# EAGLE design Group 6 (EAGLE 9.6.2)
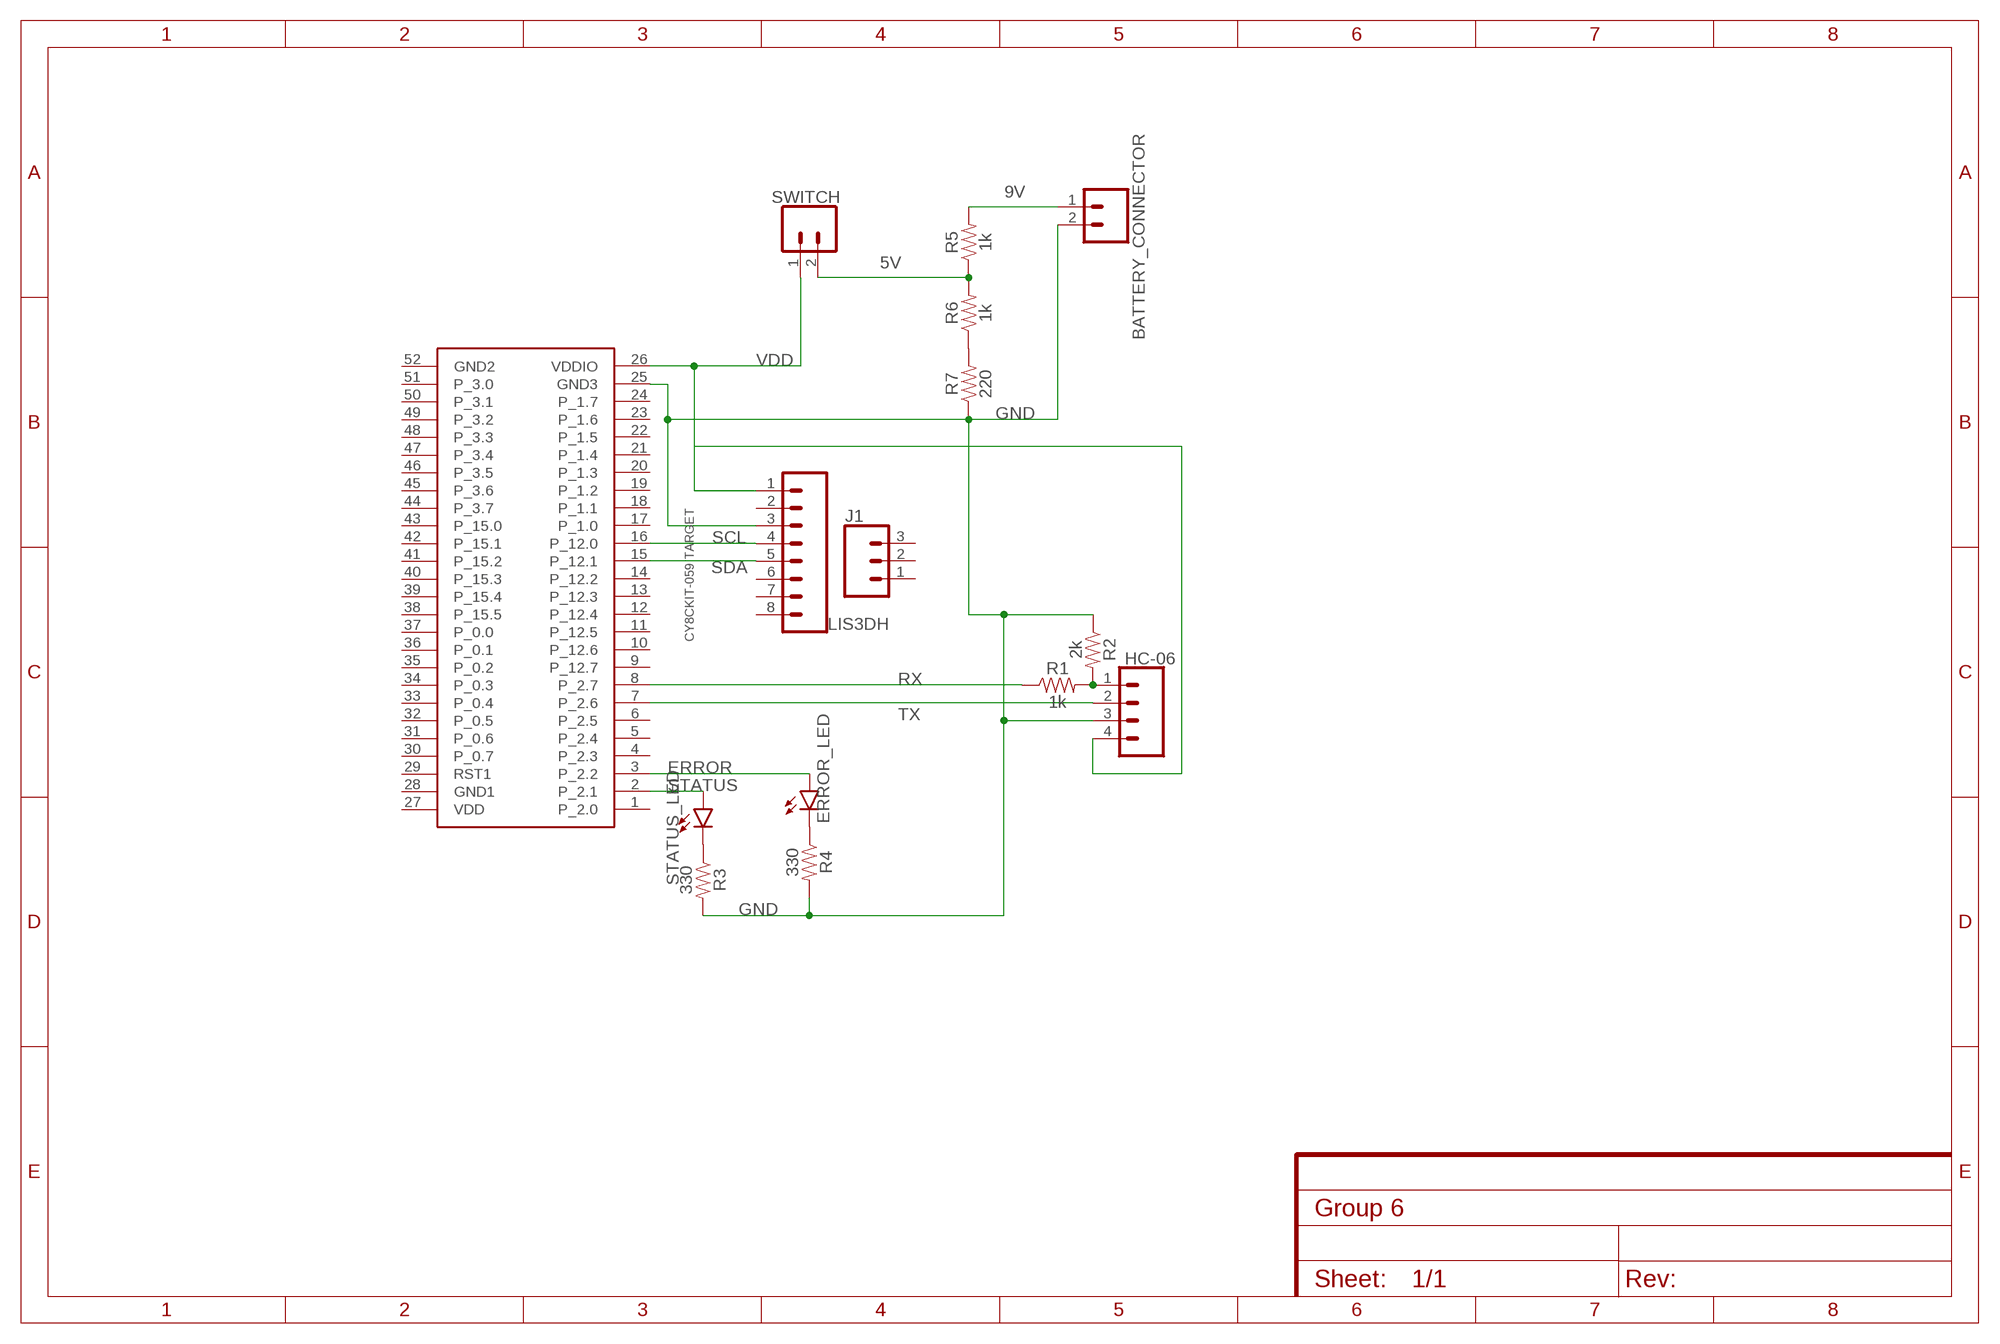
[diagram p0: schematic, sheet 1]

## Parts
BATTERY_CONNECTOR  CONN_02  [1X02]
ERROR_LED  LED-3MM-NO_SILK  [LED_3MM-NS]
HC-06  CONN_04PTH  [1X04]
J1  455-1750-1-ND  CONN_03  [1X03]
LIS3DH  CONN_08"  [1X08]
R1  1k  1KOHM-HORIZ-1/4W-1%  [AXIAL-0.3]
R2  2k  1KOHM-HORIZ-1/4W-1%  [AXIAL-0.3]
R3  330  330OHM-HORIZ-1/10W-5%  [AXIAL-0.3]
R4  330  330OHM-HORIZ-1/10W-5%  [AXIAL-0.3]
R5  1k  1KOHM-HORIZ-1/4W-1%  [AXIAL-0.3]
R6  1k  1KOHM-HORIZ-1/4W-1%  [AXIAL-0.3]
R7  220  1KOHM-HORIZ-1/4W-1%  [AXIAL-0.3]
STATUS_LED  LED-3MM-NO_SILK  [LED_3MM-NS]
SWITCH  CONN_02  [1X02]
U$1  CY8CKIT-059_TARGET_3  [CY8CKIT-059_TARGET_3]

## Nets
5V: R5.P$1 R6.P$2 SWITCH.2
9V: BATTERY_CONNECTOR.1 R5.P$2
ERROR: ERROR_LED.A U$1.3(P_2.2)
GND: BATTERY_CONNECTOR.2 HC-06.3 LIS3DH.3 R2.P$1 R3.P$2 R4.P$2 R7.P$1 U$1.25(GND3)
N$1: ERROR_LED.K(C) R4.P$1
N$2: R3.P$1 STATUS_LED.K(C)
N$3: HC-06.1 R1.P$2 R2.P$2
N$6: R6.P$1 R7.P$2
RX: R1.P$1 U$1.8(P_2.7)
SCL: LIS3DH.4 U$1.16(P_12.0)
SDA: LIS3DH.5 U$1.15(P_12.1)
STATUS: STATUS_LED.A U$1.2(P_2.1)
TX: HC-06.2 U$1.7(P_2.6)
VDD: HC-06.4 LIS3DH.1 SWITCH.1 U$1.26(VDDIO)
Unconnected: J1.1 J1.2 J1.3 LIS3DH.2 LIS3DH.6 LIS3DH.7 LIS3DH.8 U$1.1(P_2.0) U$1.4(P_2.3) U$1.5(P_2.4) U$1.6(P_2.5) U$1.9(P_12.7) U$1.10(P_12.6) U$1.11(P_12.5) U$1.12(P_12.4) U$1.13(P_12.3) U$1.14(P_12.2) U$1.17(P_1.0) U$1.18(P_1.1) U$1.19(P_1.2) U$1.20(P_1.3) U$1.21(P_1.4) U$1.22(P_1.5) U$1.23(P_1.6) U$1.24(P_1.7) U$1.29(RST1) U$1.30(P_0.7) U$1.31(P_0.6) U$1.32(P_0.5) U$1.33(P_0.4) U$1.34(P_0.3) U$1.35(P_0.2) U$1.36(P_0.1) U$1.37(P_0.0) U$1.38(P_15.5) U$1.39(P_15.4) U$1.40(P_15.3) U$1.41(P_15.2) U$1.42(P_15.1) U$1.43(P_15.0) U$1.44(P_3.7) U$1.45(P_3.6) U$1.46(P_3.5) U$1.47(P_3.4) U$1.48(P_3.3) U$1.49(P_3.2) U$1.50(P_3.1) U$1.51(P_3.0)

## Power pins joined to a net without a drawn wire
GND1: U$1.28(GND1)
GND2: U$1.52(GND2)
VDD: U$1.27(VDD)

## Library data of the parts
BATTERY_CONNECTOR SWITCH = SparkFun-Connectors:CONN_02: Multi connection point. Often used as Generic Header-pin footprint for 0.1 inch spaced/style header connections On any of the 0.1 inch spaced packages, you can populate with these: Break Away Headers - Straight <https://www.sparkfun.com/products/116> (PRT-00116) Break Away Male Headers - Right Angle <https://www.sparkfun.com/products/553> (PRT-00553) Female Headers <https://www.sparkfun.com/products/115> (PRT-00115) Break Away Headers - Machine Pin <https://www.sparkfun.com/products/117> (PRT-00117) Break Away Female Headers - Swiss Machine Pin <https://www.sparkfun.com/products/743> (PRT-00743) For SCREWTERMINALS and SPRING TERMINALS visit here: Screw Terimnals on SparkFun.com <https://www.sparkfun.com/search/results?term=Screw+Terminals> (5mm/3.5mm/2.54mm spacing) This device is also useful as a general connection point to wire up your design to another part of your project. Our various solder wires solder well into these plated through hole pads. Hook-Up Wire - Assortment (Stranded, 22 AWG) <https://www.sparkfun.com/products/11375> (PRT-11375) Hook-Up Wire - Assortment (Solid Core, 22 AWG) <https://www.sparkfun.com/products/11367> (PRT-11367) View the entire wire category on our website here <https://www.sparkfun.com/categories/141> Special notes: Molex polarized connector foot print use with: PRT-08233 with associated crimp pins and housings. 2.54_SCREWTERM for use with PRT-10571. 3.5mm Screw Terminal footprints for PRT-08084 5mm Screw Terminal footprints for use with PRT-08432
ERROR_LED STATUS_LED = SparkFun-LED:LED: LED (Generic) Standard schematic elements and footprints for 5mm, 3mm, 1206, and 0603 sized LEDs. Generic LEDs with no color specified.
HC-06 = SparkFun-Connectors:CONN_04: Multi connection point. Often used as Generic Header-pin footprint for 0.1 inch spaced/style header connections On any of the 0.1 inch spaced packages, you can populate with these: Break Away Headers - Straight <https://www.sparkfun.com/products/116> (PRT-00116) Break Away Male Headers - Right Angle <https://www.sparkfun.com/products/553> (PRT-00553) Female Headers <https://www.sparkfun.com/products/115> (PRT-00115) Break Away Headers - Machine Pin <https://www.sparkfun.com/products/117> (PRT-00117) Break Away Female Headers - Swiss Machine Pin <https://www.sparkfun.com/products/743> (PRT-00743) For SCREWTERMINALS and SPRING TERMINALS visit here: Screw Terimnals on SparkFun.com <https://www.sparkfun.com/search/results?term=Screw+Terminals> (5mm/3.5mm/2.54mm spacing) This device is also useful as a general connection point to wire up your design to another part of your project. Our various solder wires solder well into these plated through hole pads. Hook-Up Wire - Assortment (Stranded, 22 AWG) <https://www.sparkfun.com/products/11375> (PRT-11375) Hook-Up Wire - Assortment (Solid Core, 22 AWG) <https://www.sparkfun.com/products/11367> (PRT-11367) View the entire wire category on our website here <https://www.sparkfun.com/categories/141> Special notes: Molex polarized connector foot print use with SKU : PRT-08231 with associated crimp pins and housings. 1MM SMD Version SKU: PRT-10208; PROD_ID: CONN-09696
J1 = SparkFun-Connectors:CONN_03: Multi connection point. Often used as Generic Header-pin footprint for 0.1 inch spaced/style header connections On any of the 0.1 inch spaced packages, you can populate with these: Break Away Headers - Straight <https://www.sparkfun.com/products/116> (PRT-00116) Break Away Male Headers - Right Angle <https://www.sparkfun.com/products/553> (PRT-00553) Female Headers <https://www.sparkfun.com/products/115> (PRT-00115) Break Away Headers - Machine Pin <https://www.sparkfun.com/products/117> (PRT-00117) Break Away Female Headers - Swiss Machine Pin <https://www.sparkfun.com/products/743> (PRT-00743) Stackable Header - 3 Pin (Female, 0.1") <https://www.sparkfun.com/products/13875> (PRT-13875) For SCREWTERMINALS and SPRING TERMINALS visit here: Screw Terimnals on SparkFun.com <https://www.sparkfun.com/search/results?term=Screw+Terminals> (5mm/3.5mm/2.54mm spacing) This device is also useful as a general connection point to wire up your design to another part of your project. Our various solder wires solder well into these plated through hole pads. Hook-Up Wire - Assortment (Stranded, 22 AWG) <https://www.sparkfun.com/products/11375> (PRT-11375) Hook-Up Wire - Assortment (Solid Core, 22 AWG) <https://www.sparkfun.com/products/11367> (PRT-11367) View the entire wire category on our website here <https://www.sparkfun.com/categories/141> Special notes: Molex polarized connector foot print use with SKU : PRT-08232 with associated crimp pins and housings.; PROD_ID: XXX-00000
LIS3DH = SparkFun-Connectors:CONN_08: Multi connection point. Often used as Generic Header-pin footprint for 0.1 inch spaced/style header connections On any of the 0.1 inch spaced packages, you can populate with these: Break Away Headers - Straight <https://www.sparkfun.com/products/116> (PRT-00116) Break Away Male Headers - Right Angle <https://www.sparkfun.com/products/553> (PRT-00553) Female Headers <https://www.sparkfun.com/products/115> (PRT-00115) Break Away Headers - Machine Pin <https://www.sparkfun.com/products/117> (PRT-00117) Break Away Female Headers - Swiss Machine Pin <https://www.sparkfun.com/products/743> (PRT-00743) Arduino Stackable Header - 8 Pin <https://www.sparkfun.com/products/9279> (PRT-09279) For SCREWTERMINALS and SPRING TERMINALS visit here: Screw Terimnals on SparkFun.com <https://www.sparkfun.com/search/results?term=Screw+Terminals> (5mm/3.5mm/2.54mm spacing) This device is also useful as a general connection point to wire up your design to another part of your project. Our various solder wires solder well into these plated through hole pads. Hook-Up Wire - Assortment (Stranded, 22 AWG) <https://www.sparkfun.com/products/11375> (PRT-11375) Hook-Up Wire - Assortment (Solid Core, 22 AWG) <https://www.sparkfun.com/products/11367> (PRT-11367) View the entire wire category on our website here <https://www.sparkfun.com/categories/141> Special notes: Molex polarized connector foot print use with SKU : PRT-08231 with associated crimp pins and housings. 1MM SMD Version SKU: PRT-10208 NOTES ON THE VARIANTS LOCK and LOCK_LONGPADS... This footprint was designed to help hold the alignment of a through-hole component (i.e. 6-pin header) while soldering it into place. You may notice that each hole has been shifted either up or down by 0.005 of an inch from it's more standard position (which is a perfectly straight line). This slight alteration caused the pins (the squares in the middle) to touch the edges of the holes. Because they are alternating, it causes a "brace" to hold the component in place. 0.005 has proven to be the perfect amount of "off-center" position when using our standard breakaway headers. Although looks a little odd when you look at the bare footprint, once you have a header in there, the alteration is very hard to notice. Also,if you push a header all the way into place, it is covered up entirely on the bottom side.; PROD_ID: CONN-08438
R1 R5 R6 = SparkFun-Resistors:1KOHM: 1kΩ resistor A resistor is a passive two-terminal electrical component that implements electrical resistance as a circuit element. Resistors act to reduce current flow, and, at the same time, act to lower voltage levels within circuits. - Wikipedia; PROD_ID: RES-12182
R2 R7 = SparkFun-Resistors:1KOHM: 1kΩ resistor A resistor is a passive two-terminal electrical component that implements electrical resistance as a circuit element. Resistors act to reduce current flow, and, at the same time, act to lower voltage levels within circuits. - Wikipedia; PROD_ID: RES-12182; VALUE: 1k
R3 R4 = SparkFun-Resistors:330OHM: 330Ω resistor A resistor is a passive two-terminal electrical component that implements electrical resistance as a circuit element. Resistors act to reduce current flow, and, at the same time, act to lower voltage levels within circuits. - Wikipedia; PROD_ID: RES-8371
U$1 = CYKIT:CY8CKIT-059_TARGET_3

## Board
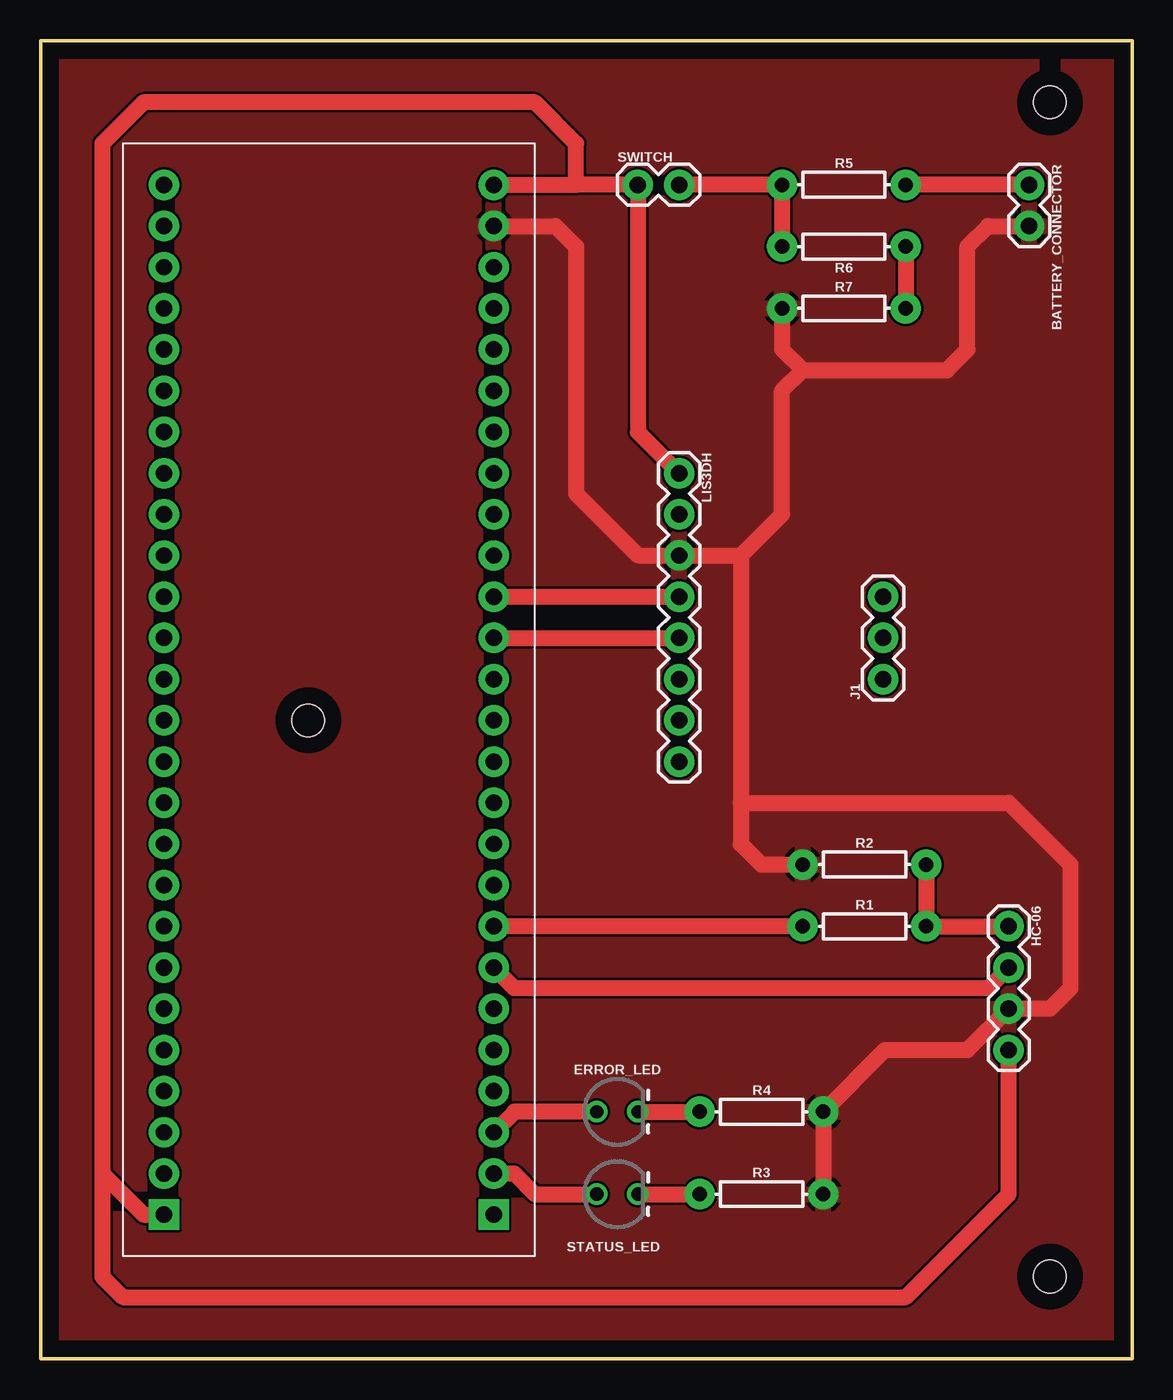
[diagram p1: board, top side]

Size 67.31 x 81.28 mm. Coordinates in mm from the lower left corner, seen from the top.
Outline: 0,0 0,81.28 67.31,81.28 67.31,0 0,0
Copper layers (1*16): Top 0.035mm / dielectric 1.5mm / Bottom 0.035mm
Design rules "default": minimum track width 6mil, minimum drill 0.35mm, track to track 6mil, track to pad 6mil, pad to pad 6mil, via to via 6mil, smd to smd 6mil, copper to edge 40mil, drill to drill 6mil, minimum pad ring 10mil, minimum via ring 8mil, stop-mask expansion 4mil, vias tented up to drill 0mil, thermal gap 10mil
Holes 2 mm at 62.23,5.08 62.23,77.47 16.51,39.37

### Footprints (pad centres in the part's own frame; a part is rotated, then mirrored left to right if it is on the bottom)
1X02 = drill 1.016 pad 1.88: 1 0,0; 2 2.54,0
LED_3MM-NS = drill 0.813: A -1.27,0; K 1.27,0
1X04 = drill 1.016 pad 1.88: 1 0,0; 2 2.54,0; 3 5.08,0; 4 7.62,0
1X03 = drill 1.016 pad 1.88: 1 0,0; 2 2.54,0; 3 5.08,0
1X08 = drill 1.016 pad 1.88: 1 0,0; 2 2.54,0; 3 5.08,0; 4 7.62,0; 5 10.16,0; 6 12.7,0; 7 15.24,0; 8 17.78,0
AXIAL-0.3 = drill 0.9 pad 1.88: P$1 -3.81,0; P$2 3.81,0
CY8CKIT-059_TARGET_3 = drill 1.016 pad 1.876 square: 1 30.48,8.89; 27 30.48,-11.43 | drill 1.016 pad 1.876: 2 27.94,8.89; 3 25.4,8.89; 4 22.86,8.89; 5 20.32,8.89; 6 17.78,8.89; 7 15.24,8.89; 8 12.7,8.89; 9 10.16,8.89; 10 7.62,8.89; 11 5.08,8.89; 12 2.54,8.89; 13 0,8.89; 14 -2.54,8.89; 15 -5.08,8.89; 16 -7.62,8.89; 17 -10.16,8.89; 18 -12.7,8.89; 19 -15.24,8.89; 20 -17.78,8.89; 21 -20.32,8.89; 22 -22.86,8.89; 23 -25.4,8.89; 24 -27.94,8.89; 25 -30.48,8.89; 26 -33.02,8.89; 28 27.94,-11.43; 29 25.4,-11.43; 30 22.86,-11.43; 31 20.32,-11.43; 32 17.78,-11.43; 33 15.24,-11.43; 34 12.7,-11.43; 35 10.16,-11.43; 36 7.62,-11.43; 37 5.08,-11.43; 38 2.54,-11.43; 39 0,-11.43; 40 -2.54,-11.43; 41 -5.08,-11.43; 42 -7.62,-11.43; 43 -10.16,-11.43; 44 -12.7,-11.43; 45 -15.24,-11.43; 46 -17.78,-11.43; 47 -20.32,-11.43; 48 -22.86,-11.43; 49 -25.4,-11.43; 50 -27.94,-11.43; 51 -30.48,-11.43; 52 -33.02,-11.43

### Placement (x,y rotation side)
BATTERY_CONNECTOR  60.96,72.39 270 top
ERROR_LED  35.56,15.24 0 top
HC-06  59.69,26.67 270 top
J1  51.94,41.91 90 top
LIS3DH  39.37,54.61 270 top
R1  50.8,26.67 0 top
R2  50.8,30.48 0 top
R3  44.45,10.16 0 top
R4  44.45,15.24 0 top
R5  49.53,72.39 0 top
R6  49.53,68.58 180 top
R7  49.53,64.77 0 top
STATUS_LED  35.56,10.16 0 top
SWITCH  36.83,72.39 0 top
U$1  19.05,39.37 270 top

### Tracks (layer width: path | path; a pad name or v marks a point on that pad's centre or on a via)
5V
  Top 1: R6.P$2 R5.P$1 SWITCH.2
9V
  Top 1: BATTERY_CONNECTOR.1 R5.P$2
ERROR
  Top 1: ERROR_LED.A 29.21,15.24 U$1.3
GND
  Top 1: R7.P$1 45.72,62.23 46.99,60.96 | BATTERY_CONNECTOR.2 58.42,69.85 57.15,68.58 57.15,62.23 55.88,60.96 46.99,60.96 | 43.18,49.53 LIS3DH.3 36.83,49.53 33.02,53.34 33.02,68.58 31.75,69.85 U$1.25 | 43.18,49.53 45.72,52.07 45.72,59.69 46.99,60.96 | R3.P$2 R4.P$2 52.07,19.05 57.15,19.05 HC-06.3 62.23,21.59 63.5,22.86 63.5,30.48 59.69,34.29 43.18,34.29 | 43.18,49.53 43.18,34.29 | 43.18,34.29 43.18,31.75 44.45,30.48 R2.P$1
  pour Top: 0,0 0,81.28 67.31,81.28 67.31,0
N$1
  Top 1: ERROR_LED.K R4.P$1
N$2
  Top 1: STATUS_LED.K R3.P$1
N$3
  Top 1: R2.P$2 R1.P$2 HC-06.1
N$6
  Top 1: R6.P$1 R7.P$2
RX
  Top 1: R1.P$1 U$1.8
SCL
  Top 1: U$1.16 LIS3DH.4
SDA
  Top 1: U$1.15 LIS3DH.5
STATUS
  Top 1: U$1.2 29.21,11.43 30.48,10.16 STATUS_LED.A
TX
  Top 1: HC-06.2 58.42,22.86 29.21,22.86 U$1.7
VDD
  Top 1: 33.02,72.39 SWITCH.1 36.83,57.15 LIS3DH.1 | U$1.26 33.02,72.39 | 33.02,72.39 33.02,74.93 30.48,77.47 6.35,77.47 3.81,74.93 3.81,11.43 | 3.81,11.43 6.35,8.89 U$1.27 | 3.81,11.43 3.81,5.08 5.08,3.81 53.34,3.81 59.69,10.16 HC-06.4

### Text on the board
tTest: + | GND | RX | TX